# Altium schematic sheet SNES_DRONE_LEVEL_SHIFTER_0.SchDoc
size A4
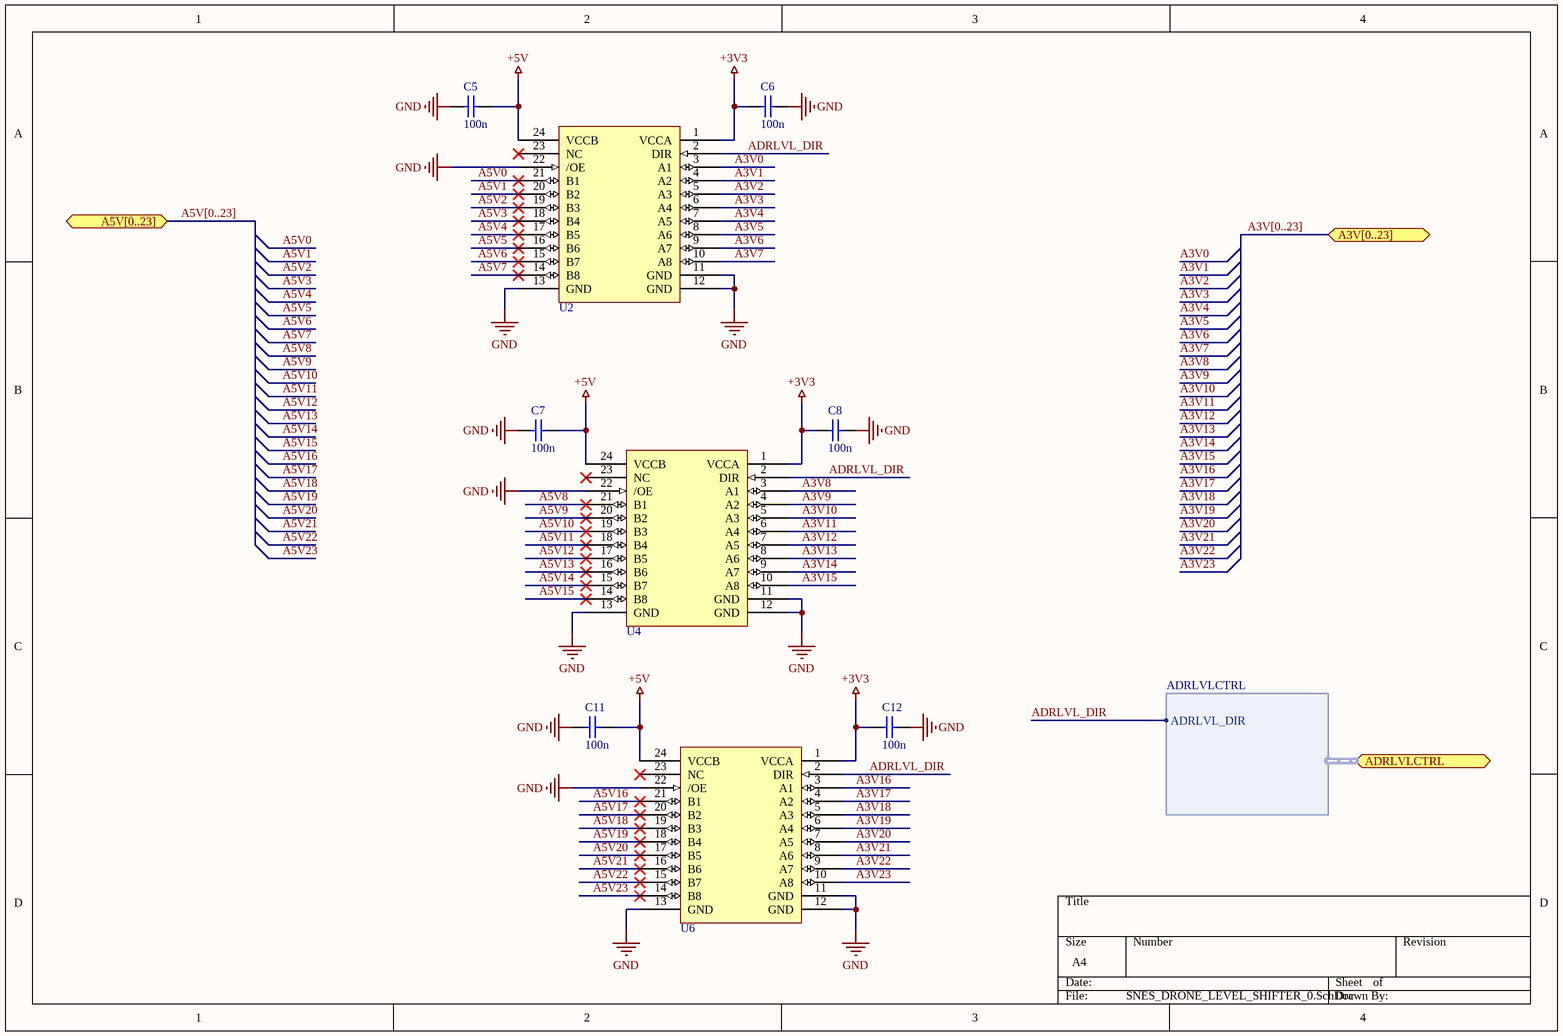
[diagram p0: SNES_DRONE_LEVEL_SHIFTER_0.SchDoc]

## Parts
C5  value 100n  [cap_0603]  (hidden comment: cap_0603)
C6  value 100n  [cap_0603]  (hidden comment: cap_0603)
C7  value 100n  [cap_0603]  (hidden comment: cap_0603)
C8  value 100n  [cap_0603]  (hidden comment: cap_0603)
C11  value 100n  [cap_0603]  (hidden comment: cap_0603)
C12  value 100n  [cap_0603]  (hidden comment: cap_0603)
U2  IC_SN74LVCC3245APWR  [TSSOP24]  (value not drawn)
U4  IC_SN74LVCC3245APWR  [TSSOP24]  (value not drawn)
U6  IC_SN74LVCC3245APWR  [TSSOP24]  (value not drawn)

## Ports
A3V[0..23] (bidir), A5V[0..23] (bidir), ADRLVLCTRL (bidir, harness ADRLVLCTRL)

## Harnesses
ADRLVLCTRL: ADRLVL_DIR

## Nets
+3V3: C6.2 C8.2 C12.2 U2.1(VCCA) U4.1(VCCA) U6.1(VCCA)
+5V: C5.1 C7.1 C11.1 U2.24(VCCB) U4.24(VCCB) U6.24(VCCB)
GND: C5.2 C6.1 C7.2 C8.1 C11.2 C12.1 U2.11(GND) U2.12(GND) U2.13(GND) U2.22(/OE) U4.11(GND) U4.12(GND) U4.13(GND) U4.22(/OE) U6.11(GND) U6.12(GND) U6.13(GND) U6.22(/OE)
A3V0: U2.3(A1)
A3V1: U2.4(A2)
A3V2: U2.5(A3)
A3V3: U2.6(A4)
A3V4: U2.7(A5)
A3V5: U2.8(A6)
A3V6: U2.9(A7)
A3V7: U2.10(A8)
A3V8: U4.3(A1)
A3V9: U4.4(A2)
A3V10: U4.5(A3)
A3V11: U4.6(A4)
A3V12: U4.7(A5)
A3V13: U4.8(A6)
A3V14: U4.9(A7)
A3V15: U4.10(A8)
A3V16: U6.3(A1)
A3V17: U6.4(A2)
A3V18: U6.5(A3)
A3V19: U6.6(A4)
A3V20: U6.7(A5)
A3V21: U6.8(A6)
A3V22: U6.9(A7)
A3V23: U6.10(A8)
A5V0: U2.21(B1)
A5V1: U2.20(B2)
A5V2: U2.19(B3)
A5V3: U2.18(B4)
A5V4: U2.17(B5)
A5V5: U2.16(B6)
A5V6: U2.15(B7)
A5V7: U2.14(B8)
A5V8: U4.21(B1)
A5V9: U4.20(B2)
A5V10: U4.19(B3)
A5V11: U4.18(B4)
A5V12: U4.17(B5)
A5V13: U4.16(B6)
A5V14: U4.15(B7)
A5V15: U4.14(B8)
A5V16: U6.21(B1)
A5V17: U6.20(B2)
A5V18: U6.19(B3)
A5V19: U6.18(B4)
A5V20: U6.17(B5)
A5V21: U6.16(B6)
A5V22: U6.15(B7)
A5V23: U6.14(B8)
ADRLVL_DIR: U2.2(DIR) U4.2(DIR) U6.2(DIR) ; port ADRLVLCTRL.ADRLVL_DIR

Not connected (* = marked no-connect by the designer): U2 23(NC)*; U4 23(NC)*; U6 23(NC)*

## Buses and harness runs
bus A3V[0..23] = port A3V[0..23]
bus A5V[0..23] = port A5V[0..23]

## Library data of the parts
C5-C8 C11 C12 = cap_0603: Capacitor
U2 U4 U6 = IC_SN74LVCC3245APWR: Bus-Transceiver, Produktreihe LVC, 8 Eingänge, 50mA, 7ns, 2.3V bis 5.5V, TSSOP 24; Manufacturer 1: TEXAS INSTRUMENTS; ComponentLink3Description: datsheet; ComponentLink3URL: http://www.ti.com/lit/ds/symlink/sn74lvcc3245a.pdf; ComponentLink4Description: farnell; ComponentLink4URL: https://at.farnell.com/texas-instruments/sn74lvcc3245apwr/bus-transceiver-8bit-tssop-24/dp/2854646?rpsku=rel3%3A2119962&st=2119962; Supplier 1: Farnell; Supplier Part Number 1: 2854646; Manufacturer Part Number 1: SN74LVCC3245APWR; Supplier Unit Price 1: 0,99; Supplier Order Qty 1: 1